# EasyEDA Pro project 智能视觉母版_V2.eprj, board 智能视觉PCB_V2
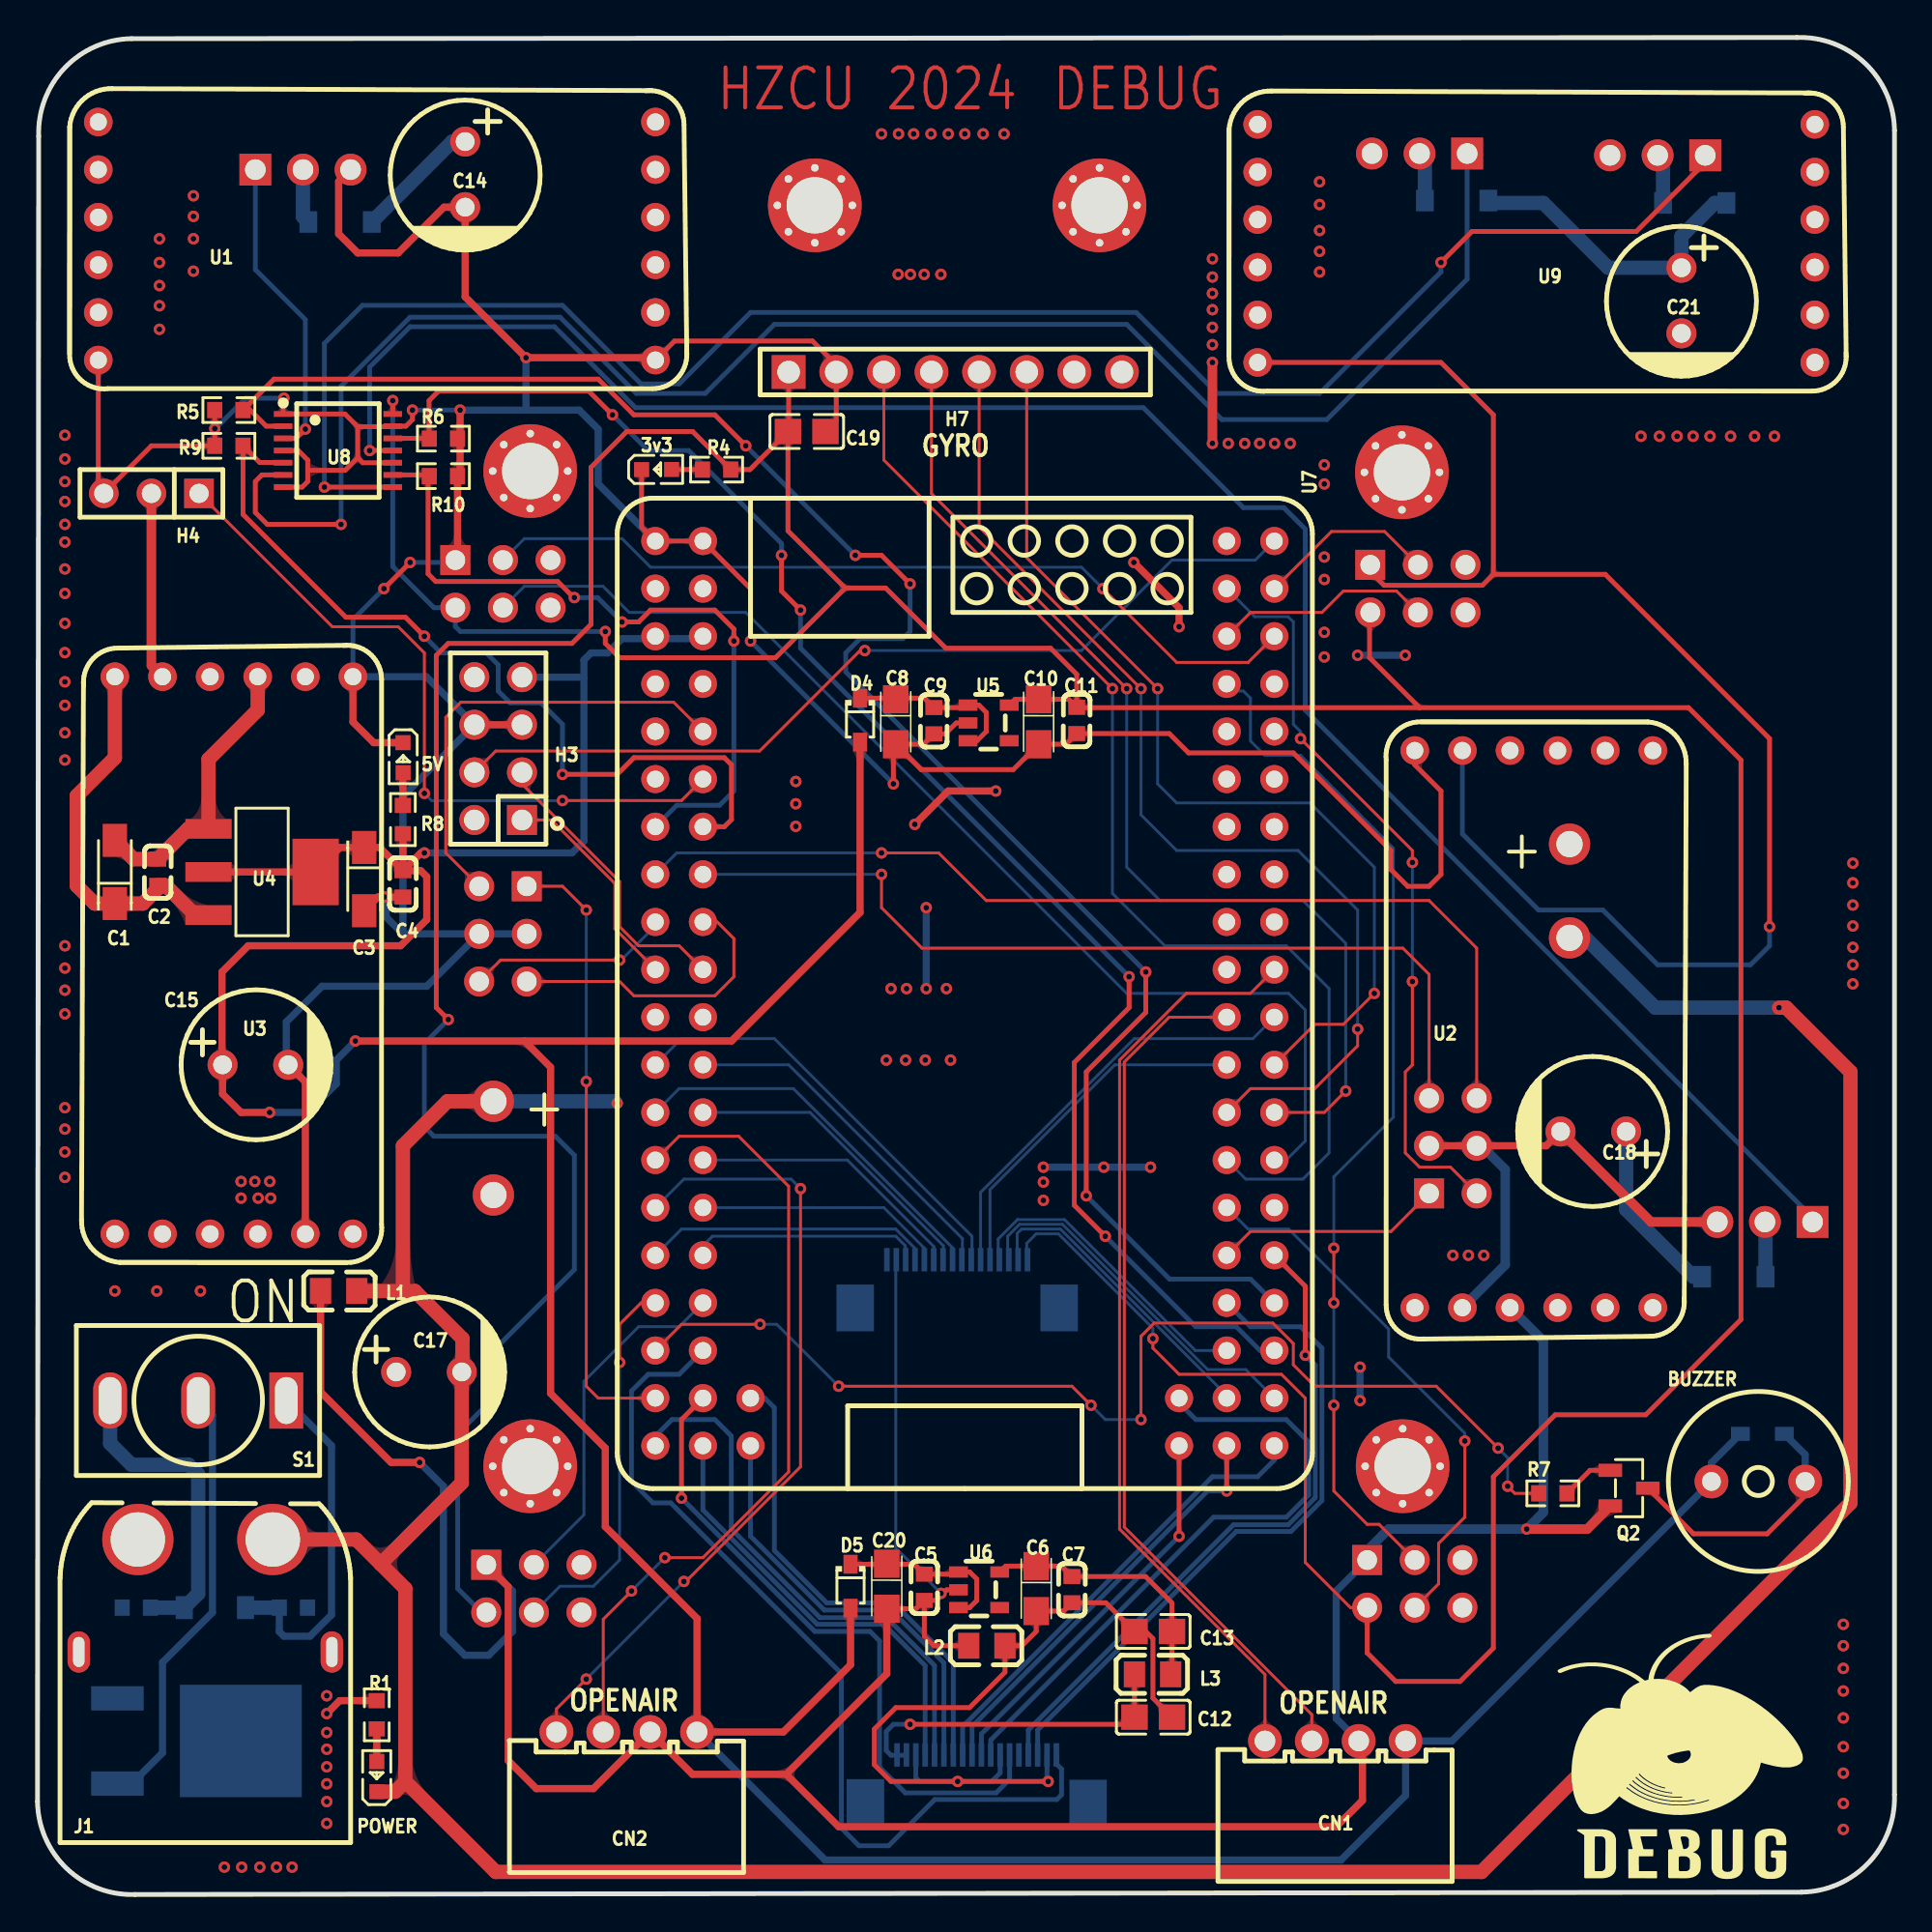
[diagram p1: board, top side]
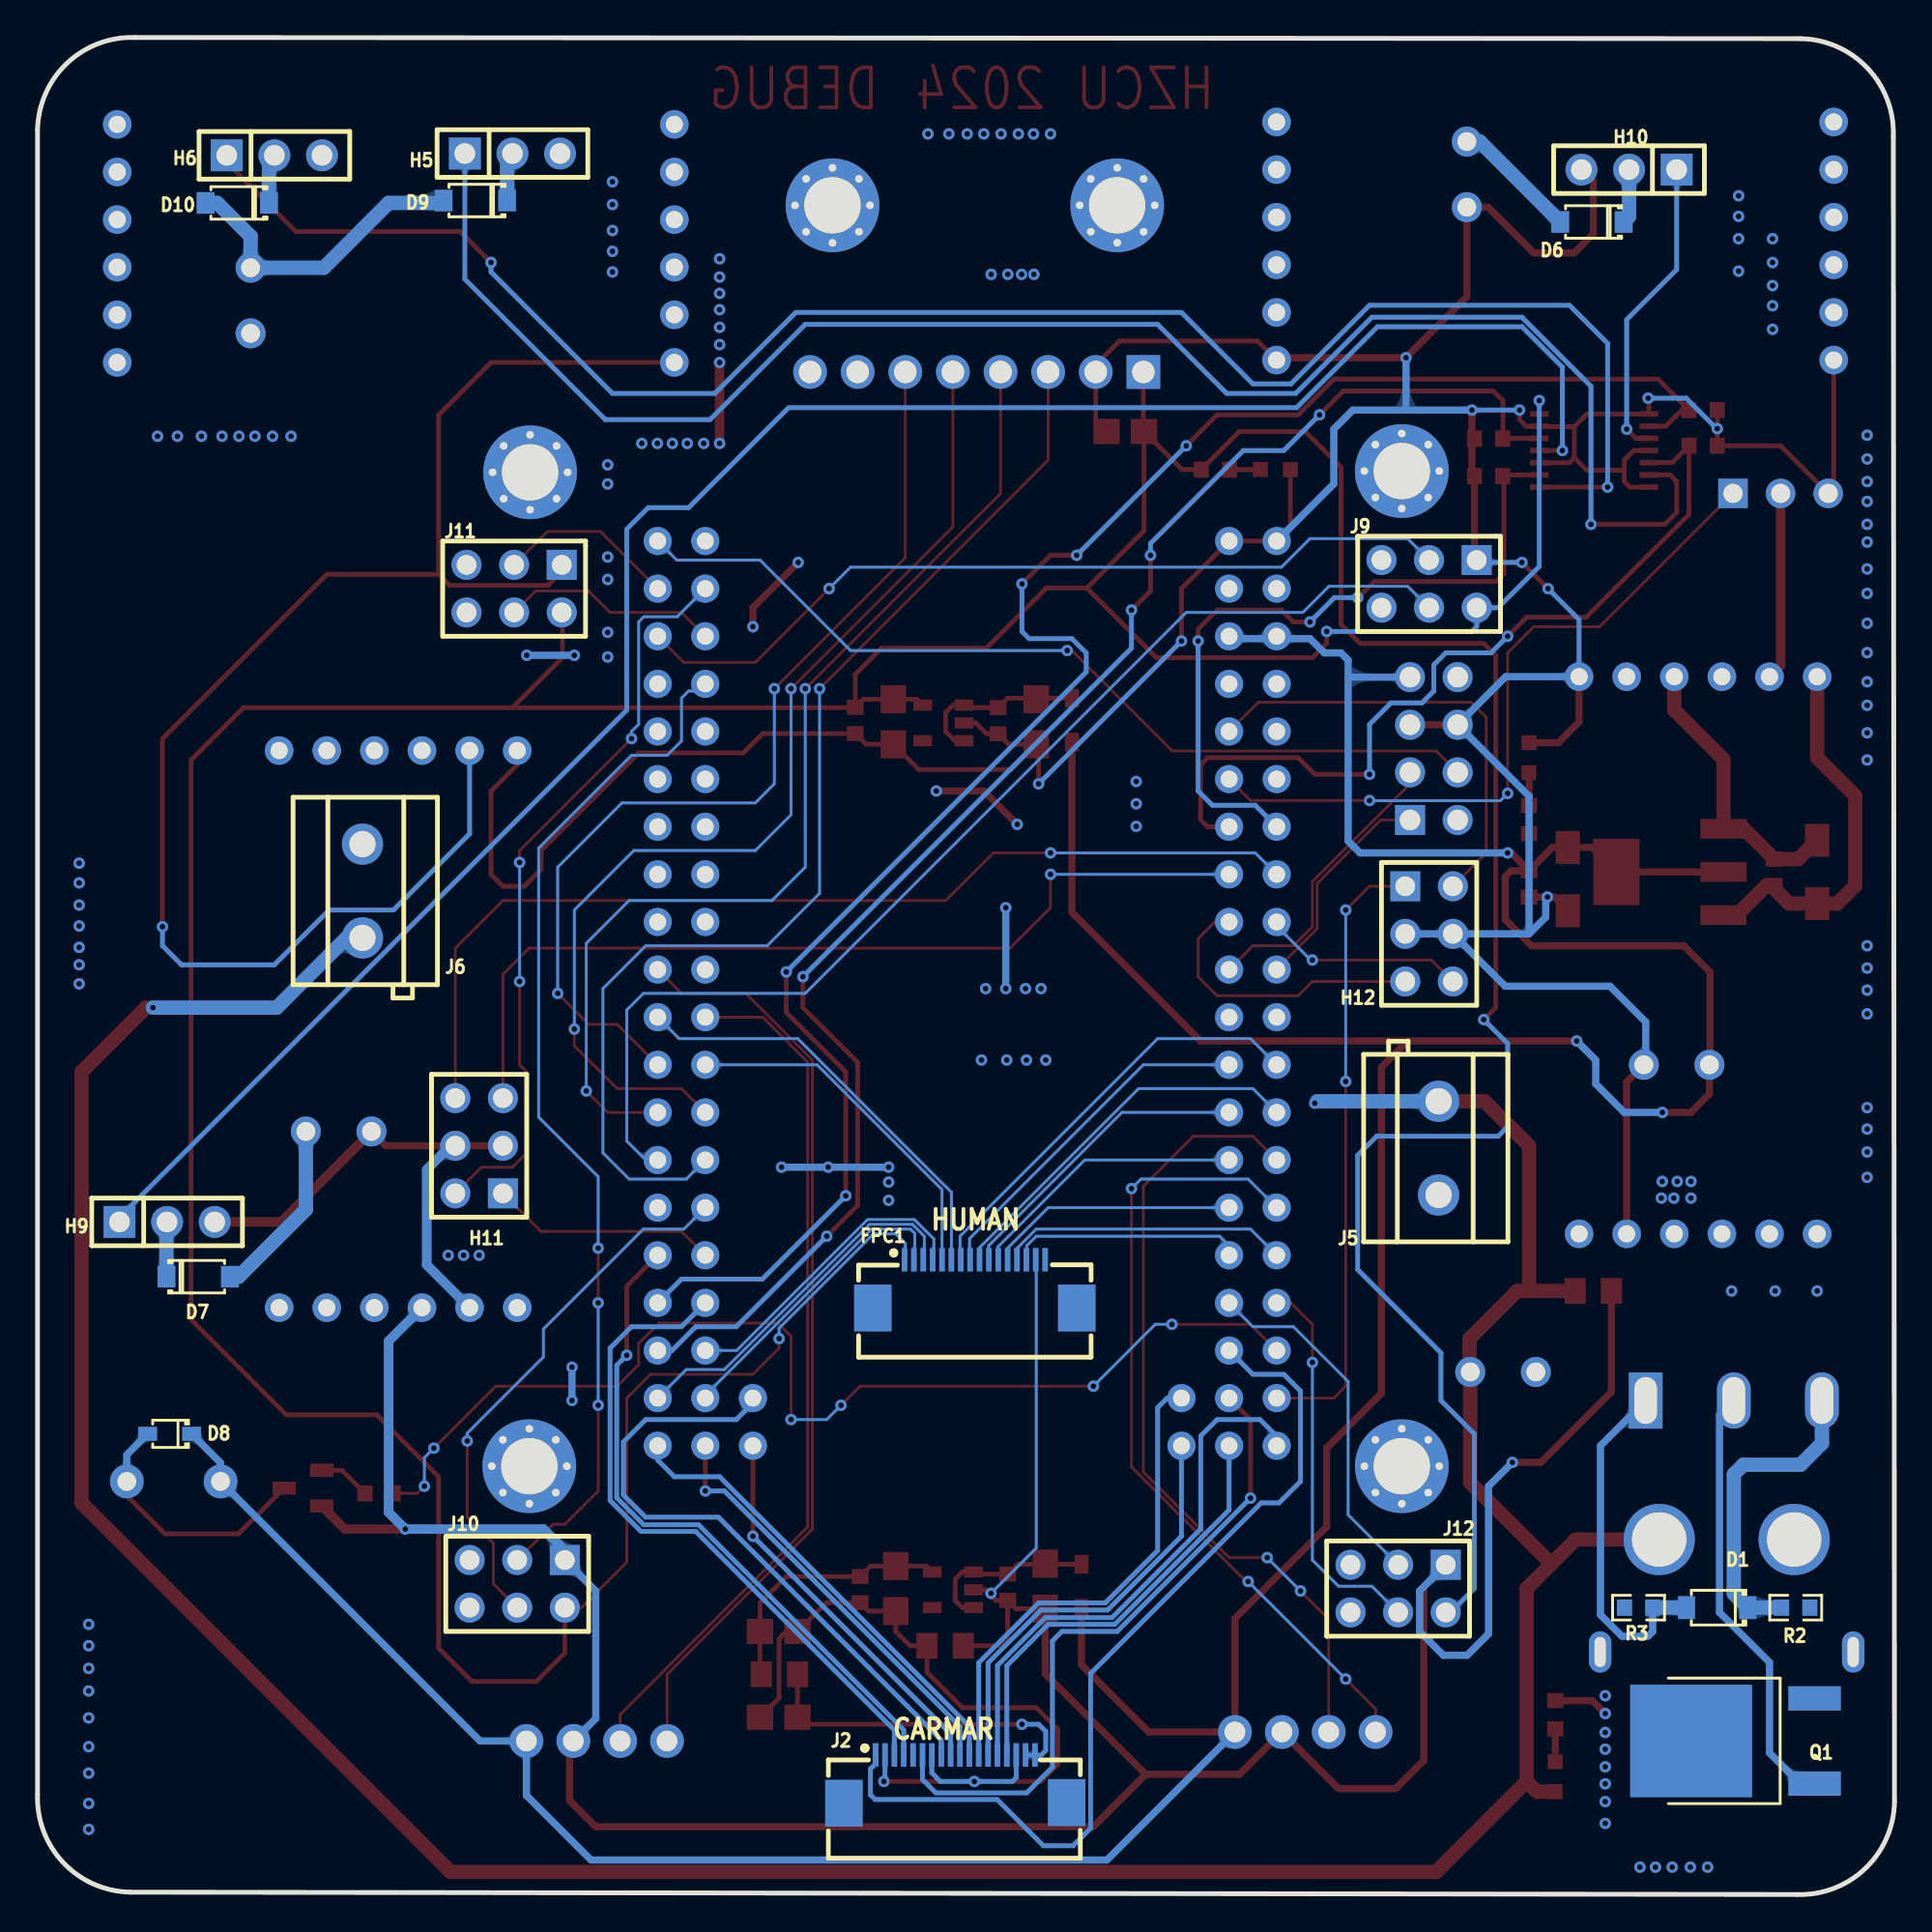
[diagram p2: board, bottom side, seen from below]

Outline 99.06 x 99.06 mm; copper layers: Top Layer, Bottom Layer. Coordinates in mm from the lower left corner of the outline.
Outline path: 0,4.95 0.06,93.79 arc(1.45,97.43) 5.02,99 93.85,99.06 arc(97.5,97.67) 99.06,94.1 99.06,5.33 arc(97.68,1.69) 94.11,0.13 5.21,0 arc(1.56,1.38) 0,4.95
Stack: Top Layer 0.035mm / Dielectric1 1.51mm FR4 er 4.5 / Bottom Layer 0.035mm

## Design rules (mm)
template: JLCPCB Capability(Two Layers Board)
spacing copperThickness1oz (default): track to track 0.102, other pairs 0.152 to 0.3
spacing copperThickness2oz: track to track 0.203, other pairs 0.152 to 0.3
track width copperThickness1oz (default): min 0.127, default 0.254, max 2.54
track width copperThickness2oz: min 0.203, default 0.254, max 2.54
differential pair differentialPair (default): width min 0.127, default 0.254, max 2.54; gap min 0.152, default 0.152
via viaSize (default): diameter min 0.5, default 0.61, max 10; hole min 0.3, default 0.305, max 6.3

## Placement (name value [footprint] x y rotation side)
3v3  NCD0603W1  [LED0603-RD]  33.02 76.01 0 top
5V  NCD0603W1  [LED0603-RD]  19.5 60.64 270 top
B1  M3螺柱孔_JX  [M3]  26.28 22.85 0 top
B2  M3螺柱孔_JX  [M3]  72.78 75.86 0 top
B3  M3螺柱孔_JX  [M3]  26.28 75.93 0 top
B4  M3螺柱孔_JX  [M3]  72.82 22.85 0 top
B5  M3螺柱孔_JX  [M3]  41.47 90.11 0 top
B6  M3螺柱孔_JX  [M3]  56.65 90.11 0 top
BUZZER  3000Hz  [BUZ-TH_BD9.6-P5.00-D0.7-FD]  91.8 22.03 0 top
C1  10uF  [CAP-SMD_L3.2-W1.6-RD-C7171]  4.13 54.55 90 top
C2  100nF  [C0603]  6.41 54.53 270 top
C3  10uF  [CAP-SMD_L3.2-W1.6-RD-C7171]  17.43 54.16 270 top
C4  100nF  [C0603]  19.49 53.91 90 top
C5  100nF  [C0603]  47.31 16.39 90 top
C6  10uF  [CASE-A_3216]  53.28 16.32 270 top
C7  100nF  [C0603]  55.18 16.26 90 top
C8  10uF  [CASE-A_3216]  45.78 62.56 270 top
C9  100nF  [C0603]  47.82 62.61 90 top
C10  10uF  [CASE-A_3216]  53.4 62.56 270 top
C11  100nF  [C0603]  55.44 62.63 90 top
C12  10uF  [C0805]  59.52 9.46 180 top
C13  10uF  [C0805]  59.52 14.03 0 top
C14  100uF  [CAP-TH_BD8.0-P3.50-D0.6-FD]  22.81 91.76 270 top
C15  100uF  [CAP-TH_BD8.0-P3.50-D0.6-FD]  11.62 44.26 0 top
C17  100uF  [CAP-TH_BD8.0-P3.50-D0.6-FD]  20.88 27.88 0 top
C18  100uF  [CAP-TH_BD8.0-P3.50-D0.6-FD]  82.99 40.7 180 top
C19  10uF  [C0805]  41.03 78.04 180 top
C20  10uF  [CASE-A_3216]  45.3 16.45 270 top
C21  100uF  [CAP-TH_BD8.0-P3.50-D0.6-FD]  87.69 85.03 270 top
CN1  XH-4AW  [CONN-TH_XH2.54-4AW]  69.23 8.19 180 top
CN2  XH-4AW  [CONN-TH_XH2.54-4AW]  31.43 8.67 180 top
D1  BZT52C16  [SOD-123_L2.7-W1.6-LS3.7-RD]  9.46 15.3 0 bottom
D4  1N5819WS  [SOD-323_L1.8-W1.3-LS2.5-RD]  43.88 62.64 270 top
D5  1N5819WS  [SOD-323_L1.8-W1.3-LS2.5-RD]  43.37 16.45 270 top
D6  1N5819W  [SOD-123_L2.8-W1.8-LS3.7-RD]  16.14 89.22 0 bottom
D7  1N5819W  [SOD-123_L2.8-W1.8-LS3.7-RD]  90.49 32.96 180 bottom
D8  1N5819WS  [SOD-323_L1.8-W1.3-LS2.5-RD]  92.01 24.57 0 bottom
D9  1N5819W  [SOD-123_L2.8-W1.8-LS3.7-RD]  75.7 90.36 0 bottom
D10  1N5819W  [SOD-123_L2.8-W1.8-LS3.7-RD]  88.4 90.23 0 bottom
FPC1  FPC-05F-16PH20  [FPC-SMD_16P-P0.50_FPC-05F-16PH20]  49.06 32.57 180 bottom
H3  -  [HDR-TH_8P-P2.54-V-F-R2-C4-S2.54-1]  24.57 61.13 90 top
H4  -  [HDR-TH_3P-P2.54-V-F]  6.08 74.74 180 top
H5  -  [HDR-TH_3P-P2.54-V-M]  73.72 92.87 180 bottom
H6  -  [HDR-TH_3P-P2.54-V-M]  86.42 92.77 180 bottom
H7  -  [HDR-TH_8P-P2.54-V-F-1]  48.96 81.22 0 top
H9  -  [HDR-TH_3P-P2.54-V-M]  92.15 35.88 180 bottom
H10  -  [HDR-TH_3P-P2.54-V-M]  14.16 92.01 0 bottom
H11  -  [HDR-TH_6P-P2.54-V-R2-C3-S2.54_A2541WV-2X3P]  75.5 39.94 90 bottom
H12  -  [HDR-TH_6P-P2.54-V-R2-C3-S2.54_A2541WV-2X3P]  24.83 51.24 270 bottom
J1  XT60PW-M  [CONN-TH_XT60PW-M]  8.95 15.94 90 top
J2  J2  [FPC-SMD_18P-P0.50_FPC-05F-18PH20]  50.1 6.16 180 bottom
J5  KF301-5.0-2P  [CONN-TH_P5.00_KF301-5.0-2P]  24.32 39.81 90 bottom
J6  KF301-5.0-2P  [CONN-TH_P5.00_KF301-5.0-2P]  81.72 53.53 270 bottom
J9  -  [HDR-TH_6P-P2.54-V-R2-C3-S2.54_A2541WV-2X3P]  24.83 69.91 0 bottom
J10  -  [HDR-TH_6P-P2.54-V-R2-C3-S2.54_A2541WV-2X3P]  73.47 16.57 0 bottom
J11  -  [HDR-TH_6P-P2.54-V-R2-C3-S2.54_A2541WV-2X3P]  73.63 69.66 0 bottom
J12  -  [HDR-TH_6P-P2.54-V-R2-C3-S2.54_A2541WV-2X3P]  26.48 16.32 0 bottom
L1  CBG201209U000T  [L0805]  16.07 32.19 180 top
L2  CBG201209U000T  [L0805]  50.64 13.27 0 top
L3  CBG201209U000T  [L0805]  59.48 11.75 0 top
POWER  NCD0603R1  [LED0603-RD_RED]  18.1 6.29 90 top
Q1  NCE60P50K  [TO-252-2_L6.6-W6.1-P4.57-LS9.9-TL-CW]  7.56 8.19 0 bottom
Q2  SS8050  [SOT-23-3_L2.9-W1.3-P1.90-LS2.4-BR]  84.9 21.68 180 top
R1  10kΩ  [R0603]  18.1 9.59 270 top
R2  4.7kΩ  [R0603]  5.27 15.3 180 bottom
R3  10kΩ  [R0603]  13.65 15.3 0 bottom
R4  10kΩ  [R0603]  36.23 76.01 180 top
R5  10kΩ  [R0603]  10.21 79.18 180 top
R6  10kΩ  [R0603]  21.65 77.66 0 top
R7  1kΩ  [R0603]  80.84 21.4 0 top
R8  10kΩ  [R0603]  19.49 57.34 90 top
R9  10kΩ  [R0603]  10.21 77.28 180 top
R10  10kΩ  [R0603]  21.65 75.66 0 top
S1  MT-0-102-A101-M200-RS  [sw-th_mt-0-103-a101-m200-rs]  8.57 26.35 0 top
U1  -  [DC_Board]  3.24 81.85 0 top
U2  -  [DC_Board]  73.47 61.02 270 top
U3  -  [DC_Board]  16.83 35.24 90 top
U4  AMS1117-5.0  [SOT-223_L6.5-W3.5-P2.30-LS7.0-BR]  11.98 54.55 180 top
U5  RT9013  [SOT-23-5_L2.9-W1.6-P0.95-LS2.8-BR]  50.74 62.49 180 top
U6  RT9013  [SOT-23-5_L2.9-W1.6-P0.95-LS2.8-BR]  50.23 16.25 180 top
U7  MIMXRT1064xVL_CoreBoard  [MIMXRT1064xVL_CoreBoard - 3D]  49.47 48.07 270 top
U8  SN74HC125PWR  [TSSOP-14_L5.0-W4.4-P0.65-LS6.5-BL]  16.03 77.02 270 top
U9  -  [DC_Board]  65.09 81.72 0 top

## Footprints (pads in the part's own frame, mm; a bottom-side part is the same pattern mirrored in y, then rotated)
BUZ-TH_BD9.6-P5.00-D0.7-FD
  round 1.8 hole 1: 1(-2.5,0) 2(2.5,0)
C0603
  rect 0.8x0.9 smd: 1(-0.7,0) 2(0.7,0)
C0805
  rect 1.41x1.35 smd: 1(-1,0) 2(1,0)
CAP-SMD_L3.2-W1.6-RD-C7171
  rect 1.758x1.296 smd: 1(-1.687,0) 2(1.687,0)
CAP-TH_BD8.0-P3.50-D0.6-FD
  round 1.6 hole 1: 1(-1.75,0) 2(1.75,0)
CASE-A_3216
  rect 1.5x1.359 smd: 1(-1.2,0) 2(1.2,0)
CONN-TH_P5.00_KF301-5.0-2P
  round 2.2 hole 1.4: 1(-2.5,0) 2(2.5,0)
CONN-TH_XH2.54-4AW
  round 1.8 hole 1.1: 1(-3.751,0) 2(-1.248,0) 3(1.251,0) 4(3.751,0)
CONN-TH_XT60PW-M
  round 3.8 hole 2.9: 1(3,-3.6) 2(3,3.6)
  oval 2.2x1.2 hole 1.6x0.6: 3(-3,6.75) 4(-3,-6.75)
DC_Board
  round 1.524 hole 0.914: 1(0,12.7) 1(0,10.16) 1(0,7.62) 2(29.72,12.7) 2(29.72,10.16) 2(29.72,7.62) 3(0,5.08) 3(0,2.54) 3(0,0) 3(29.72,5.08) 3(29.72,2.54) 3(29.72,0)
FPC-SMD_16P-P0.50_FPC-05F-16PH20
  rect 0.3x1.25 smd: 1(-3.75,1.288) 2(-3.25,1.288) 3(-2.75,1.288) 4(-2.25,1.288) 5(-1.75,1.288) 6(-1.25,1.288) 7(-0.75,1.288) 8(-0.25,1.288) 9(0.25,1.288) 10(0.75,1.288) 11(1.25,1.288) 12(1.75,1.288) 13(2.25,1.288) 14(2.75,1.288) 15(3.25,1.288) 16(3.75,1.288)
  rect 2x2.5 smd: 17(5.44,-1.288) 18(-5.44,-1.288)
FPC-SMD_18P-P0.50_FPC-05F-18PH20
  rect 0.3x1.25 smd: 1(-4.25,1.288) 2(-3.75,1.288) 3(-3.25,1.288) 4(-2.75,1.288) 5(-2.25,1.288) 6(-1.75,1.288) 7(-1.25,1.288) 8(-0.75,1.288) 9(-0.25,1.288) 10(0.25,1.288) 11(0.75,1.288) 12(1.25,1.288) 13(1.75,1.288) 14(2.25,1.288) 15(2.75,1.288) 16(3.25,1.288) 17(3.75,1.288) 18(4.25,1.288)
  rect 2x2.5 smd: 19(-5.94,-1.288) 20(5.94,-1.252)
HDR-TH_3P-P2.54-V-F
  rect 1.575x1.575 hole 1.02: 1(-2.54,0)
  round 1.575 hole 1.02: 2(0,0) 3(2.54,0)
HDR-TH_3P-P2.54-V-M
  rect 1.7x1.7 hole 1.1: 1(-2.54,0)
  round 1.7 hole 1.1: 2(0,0) 3(2.54,0)
HDR-TH_6P-P2.54-V-R2-C3-S2.54_A2541WV-2X3P
  rect 1.6x1.6 hole 1.05: 1(-2.54,-1.27)
  round 1.6 hole 1.05: 2(-2.54,1.27) 3(0,-1.27) 4(0,1.27) 5(2.54,-1.27) 6(2.54,1.27)
HDR-TH_8P-P2.54-V-F-1
  rect 1.8x1.8 hole 1.2: 1(-8.89,0)
  round 1.8 hole 1.2: 2(-6.35,0) 3(-3.81,0) 4(-1.27,0) 5(1.27,0) 6(3.81,0) 7(6.35,0) 8(8.89,0)
HDR-TH_8P-P2.54-V-F-R2-C4-S2.54-1
  rect 1.6x1.6 hole 1.1: 1(-3.81,-1.27)
  round 1.6 hole 1.1: 2(-3.81,1.27) 3(-1.27,-1.27) 4(-1.27,1.27) 5(1.27,-1.27) 6(1.27,1.27) 7(3.81,-1.27) 8(3.81,1.27)
L0805
  rect 1.133x1.377 smd: 1(-0.966,0) 2(0.966,0)
LED0603-RD
  rect 0.8x0.8 smd: 1(-0.799,-0.004) 2(0.799,0.004)
LED0603-RD_RED
  rect 0.8x0.8 smd: 1(-0.799,-0.004) 2(0.799,0.004)
M3
  round 0.6 hole 0.405x0.4: 1(-2,0) 1(-1.41,1.409) 1(-1.41,-1.41) 1(0,2) 1(0,-2) 1(1.41,1.409) 1(1.41,-1.41) 1(2,0)
  round 5 hole 3.005x3: 1(0,0)
MIMXRT1064xVL_CoreBoard - 3D
  round 1.5 hole 0.9: 1(-24.13,-16.51) 2(-24.13,-13.97) 3(-21.59,-16.51) 4(-21.59,-13.97) 5(-19.05,-16.51) 6(-19.05,-13.97) 7(-16.51,-16.51) 8(-16.51,-13.97) 9(-13.97,-16.51) 10(-13.97,-13.97) 11(-11.43,-16.51) 12(-11.43,-13.97) 13(-8.89,-16.51) 14(-8.89,-13.97) 15(-6.35,-16.51) 16(-6.35,-13.97) 17(-3.81,-16.51) 18(-3.81,-13.97) 19(-1.27,-16.51) 20(-1.27,-13.97) 21(1.27,-16.51) 22(1.27,-13.97) 23(3.81,-16.51) 24(3.81,-13.97) 25(6.35,-16.51) 26(6.35,-13.97) 27(8.89,-16.51) 28(8.89,-13.97) 29(11.43,-16.51) 30(11.43,-13.97) 31(13.97,-16.51) 32(13.97,-13.97) 33(16.51,-16.51) 34(16.51,-13.97) 35(19.05,-16.51) 36(19.05,-13.97) 37(21.59,-16.51) 38(21.59,-13.97) 39(24.13,-16.51) 40(24.13,-13.97) 41(21.59,-11.43) 42(24.13,-11.43) 43(24.13,11.43) 44(21.59,11.43) 45(24.13,13.97) 46(24.13,16.51) 47(21.59,13.97) 48(21.59,16.51) 49(19.05,13.97) 50(19.05,16.51) 51(16.51,13.97) 52(16.51,16.51) 53(13.97,13.97) 54(13.97,16.51) 55(11.43,13.97) 56(11.43,16.51) 57(8.89,13.97) 58(8.89,16.51) 59(6.35,13.97) 60(6.35,16.51) 61(3.81,13.97) 62(3.81,16.51) 63(1.27,13.97) 64(1.27,16.51) 65(-1.27,13.97) 66(-1.27,16.51) 67(-3.81,13.97) 68(-3.81,16.51) 69(-6.35,13.97) 70(-6.35,16.51) 71(-8.89,13.97) 72(-8.89,16.51) 73(-11.43,13.97) 74(-11.43,16.51) 75(-13.97,13.97) 76(-13.97,16.51) 77(-16.51,13.97) 78(-16.51,16.51) 79(-19.05,13.97) 80(-19.05,16.51) 81(-21.59,13.97) 82(-21.59,16.51) 83(-24.13,13.97) 84(-24.13,16.51)
R0603
  rect 0.806x0.864 smd: 1(-0.753,0) 2(0.753,0)
SOD-123_L2.7-W1.6-LS3.7-RD
  rect 0.91x1.22 smd: 1(-1.635,0) 2(1.635,0)
SOD-123_L2.8-W1.8-LS3.7-RD
  rect 0.95x1.15 smd: 1(-1.692,0) 2(1.692,0)
SOD-323_L1.8-W1.3-LS2.5-RD
  rect 1x0.75 smd: 1(-1.173,0) 2(1.173,0)
SOT-23-3_L2.9-W1.3-P1.90-LS2.4-BR
  rect 1.25x0.7 smd: 1(1,-0.95) 2(1,0.95) 3(-1,0)
SOT-23-5_L2.9-W1.6-P0.95-LS2.8-BR
  rect 1.001x0.6 smd: 1(1.1,-0.95) 2(1.1,0) 3(1.1,0.95) 4(-1.1,0.95) 5(-1.1,-0.95)
SOT-223_L6.5-W3.5-P2.30-LS7.0-BR
  rect 2.465x1.05 smd: 1(2.857,-2.3) 2(2.857,0) 3(2.857,2.3)
  rect 2.465x3.54 smd: 4(-2.857,0)
sw-th_mt-0-103-a101-m200-rs
  rect 1.8x3 hole 1.2x2.5: 1(4.7,0)
  oval 1.8x3 hole 1.2x2.5: 2(0,0) 3(-4.7,0)
TO-252-2_L6.6-W6.1-P4.57-LS9.9-TL-CW
  rect 2.8x1.3 smd: 1(-3.292,2.273) 3(-3.292,-2.273)
  rect 6.5x6 smd: 2(3.292,0)
TSSOP-14_L5.0-W4.4-P0.65-LS6.5-BL
  rect 0.305x0.991 smd: 1(-1.95,-2.925) 2(-1.3,-2.925) 3(-0.65,-2.925) 4(0,-2.925) 5(0.65,-2.925) 6(1.3,-2.925) 7(1.95,-2.925) 8(1.95,2.925) 9(1.3,2.925) 10(0.65,2.925) 11(0,2.925) 12(-0.65,2.925) 13(-1.3,2.925) 14(-1.95,2.925)

## Nets
As in the schematic.

Pads without a net: B1 1; B2 1; B3 1; B4 1; B5 1; B6 1; FPC1 16 17 18; H3 2 8; H7 7 8; J1 3 4; J2 5 19 20; J9 5 6; J10 5 6; J11 5 6; J12 5 6; U5 4; U6 4; U7 3 4 7 8 9 11 21 22 65 67 68 69 70 71 72 73 74 75 76 78 83

## Via types
v1: diameter 0.61, hole 0.305, Top Layer to Bottom Layer, 226 vias

## Routing (per net, layer and track width the routed paths; a pad name or vN(x,y) marks a point on that pad's centre or on a via; arc(x,y) is an arc through that point)
3V3: length 305.6
  Top Layer w0.152: J10.2 70.04,15.3 67.63,17.72 67.63,26.48 66.36,27.75 60.9,27.75 59.5,29.15 v1(59.5,29.65)
  Top Layer w0.254: 43.08,69.69 45.24,69.69 48.45,66.48 54.04,66.48 55.44,65.09 C11.2 ; 43.08,69.69 39.37,65.98 31.05,65.98 30.29,66.74 v1(30.29,67.37) ; 43.08,69.69 40.03,72.74 C19.2 ; 73.72,63.31 88.07,63.31 90.87,60.51 90.87,30.67 85.79,25.59 80.96,25.59 77.66,22.29 77.66,13.14 75.88,11.37 72.45,11.37 70.93,12.89 J10.2 ; 73.72,63.31 55.46,63.31 C11.2 ; 73.72,63.31 71.06,65.98 71.06,68.35 J11.2 ; H7.1 40.07,78.07 C19.2 ; C19.2 38,76.01 R4.1 34.95,78.04 31.43,78.04 29.53,76.14 29.53,67.75 28.51,66.74 21.91,66.74 21.27,66.1 21.27,47.31 v1(21.91,46.67) ; U5.5 52.15,63.76 C10.1 55.01,63.76 C11.2 ; U8.14 v1(18.95,79.69)
  Bottom Layer w0.152: v1(59.5,29.65) 59.5,30.2 54.46,35.24 53.28,35.24 52.77,34.73 52.77,34.08
  Bottom Layer w0.254: J12.2 23.69,15.05 22.42,16.32 22.42,24.57 24.19,26.35 24.19,28.89 28.64,33.34 28.64,39.43 27.62,40.45 21.15,40.45 20.64,40.96 20.64,45.4 v1(21.91,46.67) ; v1(18.95,79.69) 18.95,70.84 21.15,68.64 J9.2 22.29,67.64 22.56,67.37 v1(30.29,67.37)
3V3_CAM: length 14
  Top Layer w0.254: U6.5 51.64,17.52 C6.1 54.63,17.52 C7.2 59.11,16.96 60.52,15.56 60.52,14.03 C13.2 60.52,11.82 L3.2
6V: length 30.6
  Top Layer w0.508: H4.2 6.08,65.55 U3.2
  Top Layer w0.762: U3.2 4.13,60.64 2.1,58.61 2.1,53.81 3.05,52.86 C1.1 5.62,52.86 6.41,53.66 C2.2 6.83,53.83 8.41,52.25 U4.3
8V_1: length 6.8
  Bottom Layer w0.762: C14.1 22.12,93.51 D6.2
8V_2: length 9.7
  Bottom Layer w0.762: C18.1 84.74,36.54 88.33,32.96 D7.2
8V_3: length 16.6
  Bottom Layer w0.762: D9.2 77.52,90.23 80.33,90.23 83.78,86.78 C21.1 87.69,88.45 89.47,90.23 D10.2
+5V: length 238.1
  Top Layer w0.381: v1(20.64,55.56) 20.45,55.56 C4.2 ; 25.97,45.53 37.02,45.53 43.88,52.39 D4.2 ; 25.97,45.53 27.37,44.13 27.37,26.73 30.29,23.81 30.29,19.62 35.18,14.73 CN2.1 39.79,8.67 43.37,12.25 D5.2 ; 25.97,45.53 v1(16.95,45.53) ; C4.2 19.49,56.58 R8.1 ; C4.2 20.45,54.61 20.76,54.29 20.76,52.01 19.37,50.61 11.24,50.61 9.84,49.21 9.84,44.29 C15.1 9.87,42.71 10.86,41.72 v1(12.38,41.72) ; C4.2 18.25,55.85 C3.1 16.14,55.85 U4.4 U4.2
  Bottom Layer w0.381: CN2.1 42.01,1.84 69.53,1.84 72.98,5.29 CN1.1 75.45,8.19 BUZZER.1 89.3,23.03 D8.1 ; v1(16.95,45.53) 15.94,44.51 15.94,43.24 14.41,41.72 v1(12.38,41.72) ; v1(20.64,55.56) 28.51,55.56 29.15,56.2 29.15,64.87 ; 29.15,64.87 29.08,64.94 H3.7 ; 29.15,64.87 29.15,65.85 29.53,66.23 30.42,66.23 31.18,66.99 35.37,66.99 U7.6
GND: length 578.7
  Top Layer w0.254: U6.2 48.5,16.25 47.94,15.69 C5.1 ; U2.3 73.47,60.26 74.87,58.86 74.87,54.42 74.23,53.78 73.09,53.78 72.2,54.67 72.2,55.69 66.99,60.9 61.4,60.9 60.37,61.93 C11.1 54.87,61.36 C10.2 52.05,60.01 47.13,60.01 C8.2 ; U5.2 49.01,62.49 48.43,61.91 C9.1 47.26,61.36 C8.2 ; 14.41,75.97 16.41,75.97 17.08,76.64 ; 14.41,75.97 14.41,76.52 13.91,77.02 U8.4 ; 14.41,75.97 14.41,75.37 14.12,75.07 U8.7 ; J11.1 71.09,70.57 71.83,69.84 77.08,69.84 77.66,70.42 ; 3v3.1 32.22,72.93 U7.1 U7.2 38.04,69.66 v1(38.04,66.86) ; v1(92.39,51.62) 92.39,61.66 83.63,70.42 77.66,70.42 ; U1.3 3.24,75.03 H4.3 6.08,77.28 R9.2 v1(9.46,78.19) R5.2 ; 17.08,76.64 17.35,76.37 U8.10 ; 17.08,76.64 17.08,78.29 ; C5.1 46.86,15.25 C20.2 ; C5.1 47.31,13.78 47.82,13.27 L2.1 ; 77.66,70.42 77.66,78.93 74.87,81.72 U9.3 ; C8.2 45.66,61.23 v1(45.66,59.24) ; v1(18.48,69.66) v1(19.88,71.06) ; 13.1,79.69 U8.1 16.4,78.97 17.08,78.29 ; C19.1 42.61,78.62 42.61,81.6 41.34,82.87 33.98,82.87 U1.3 ; 17.08,78.29 18.92,78.29 U8.13 19.65,78.32 20,78.68 v1(20,79.18)
  Top Layer w0.381: C4.1 v1(18.52,53.21) 18.16,53.21 C3.2 ; L1.2 15.1,26.81 18.86,23.05 v1(20.38,23.05) ; C18.2 80.48,39.94 H11.4 H11.3 ; v1(51.12,58.86) 48.58,58.86 v1(46.8,57.09) ; U3.3 16.83,62.55 17.93,61.44 5V.1 ; U3.3 14.29,43.34 C15.2 ; v1(58.48,71.06) 60.9,68.64 v1(60.9,67.63) ; C20.2 45.3,11.77 39.94,6.41 ; U1.3 32.84,81.98 v1(26.06,81.98) 22.81,85.22 C14.2 21.68,90.01 19.24,87.57 17.08,87.57 16.07,88.58 16.07,91.38 H10.3 ; H3.6 H3.5 ; 22.54,77.79 R6.2 ; 22.54,77.79 22.54,75.79 R10.2 22.41,71.3 J9.1 ; 22.54,77.79 v1(22.54,79.18) ; 39.94,6.41 34.94,6.41 CN2.2 32.67,8.67 29.65,5.65 26.61,5.65 25.11,7.15 25.11,16.42 J12.1 ; 39.94,6.41 42.74,3.62 69.28,3.62 70.68,5.02 70.68,7.99 CN1.2
  Top Layer w0.508: C18.2 86.07,35.88 H9.3 ; v1(79.44,19.49) 82.67,19.49 Q2.2
  Top Layer w0.762: U3.3 11.75,63.18 9.12,60.56 U4.1 8.03,56.85 C2.1 5.13,55.23 C1.2
  Bottom Layer w0.152: FPC1.15 45.78,33.84 45.78,18.48 v1(48.2,16.06)
  Bottom Layer w0.254: 9.46,78.17 11.11,79.82 v1(13.14,79.82) ; v1(19.88,71.06) 22.16,71.06 J9.1 ; 18.35,69.53 16.83,68.01 U3.3 ; v1(92.39,51.62) 92.39,50.61 91.38,49.59 86.42,49.59 83.5,52.51 80.07,52.51 76.01,56.58 U2.3 ; v1(38.04,66.86) v1(45.66,59.24) ; v1(22.54,79.18) v1(20,79.18)
  Bottom Layer w0.381: v1(20.38,23.05) 21.65,21.78 21.65,13.91 22.8,12.76 24.07,12.76 25.34,14.03 25.34,16.19 J12.1 ; v1(53.66,38.8) v1(56.88,38.8) v1(59.37,38.8) ; v1(72.96,66.1) v1(70.42,66.1) ; v1(18.52,53.21) 18.61,53.12 18.61,52.13 19.49,51.24 ; C15.2 13.27,44.36 13.27,46.54 15.18,48.45 20.76,48.45 H12.4 ; 26.06,79.18 28.89,79.18 29.91,78.17 29.91,75.25 U7.1 ; 26.06,79.18 v1(26.06,81.98) ; 26.06,79.18 v1(22.54,79.18) ; v1(47.41,48.32) v1(47.41,52.64) ; CN1.2 69.28,9.39 69.28,16.19 J10.1 ; H12.4 H12.3 ; H12.4 19.49,51.24 ; 19.49,51.24 19.49,58.59 H3.6 20.74,64.96 U3.3 ; v1(70.55,28.13) v1(70.55,26.35)
  Bottom Layer w0.508: J10.1 70.93,18.35 72.07,19.49 v1(79.44,19.49) 80.33,20.38 80.33,29.52 U2.3 ; U2.3 78.3,33.59 78.3,38.67 77.03,39.94 H11.4
  vias: v1(6.5,88.32) v1(6.5,87.05) v1(6.5,85.82) v1(6.5,84.75) v1(6.5,83.49) v1(8.32,90.61) v1(8.32,89.52) v1(8.32,88.32) v1(8.32,86.59) v1(9.97,1.46) v1(10.86,38.04) v1(10.86,37.15) v1(10.89,1.46) v1(11.59,38.04) v1(11.77,37.15) v1(11.86,1.46) v1(12.39,38.04) v1(12.44,37.15) v1(12.75,1.46) v1(13.58,1.46) v1(40.45,59.37) v1(40.45,58.18) v1(40.45,56.98) v1(45.28,44.51) v1(45.53,48.32) v1(45.91,86.42) v1(46.31,44.51) v1(46.36,48.32) v1(46.57,86.42) v1(47.3,86.42) v1(47.36,44.51) v1(48.19,86.42) v1(48.49,48.32) v1(48.7,44.51) v1(53.66,38) v1(53.66,37.03) v1(75.5,34.1) v1(76.33,34.1) v1(77.15,34.1) v1(85.53,77.79) v1(86.52,77.79) v1(87.46,77.79) v1(88.32,77.79) v1(89.22,77.79) v1(90.31,77.79) v1(91.6,77.79) v1(92.66,77.79) v1(96.33,14.41) v1(96.33,13.27) v1(96.33,12.06) v1(96.33,10.86) v1(96.33,9.42) v1(96.33,7.88) v1(96.33,6.47) v1(96.33,4.86) v1(96.33,3.47) v1(96.84,55.01) v1(96.84,53.96) v1(96.84,52.78) v1(96.84,51.66) v1(96.84,50.52) v1(96.84,49.59) v1(96.84,48.58)
GNDBAT: length 188.9
  Top Layer w0.762: 19.62,6.03 19.08,5.49 18.11,5.49 ; 19.62,6.03 24.45,1.21 77.03,1.21 96.71,20.89 96.71,43.88 93.28,47.31 v1(92.9,47.31) ; 19.62,6.03 19.62,16.32 18.31,17.63 ; 19.49,32.19 20.13,32.19 22.67,29.65 22.67,27.91 C17.2 22.63,21.96 18.31,17.63 ; 19.49,32.19 19.49,39.94 21.87,42.31 J5.2 ; 19.49,32.19 L1.1 ; J1.1 17,18.94 18.31,17.63
  Bottom Layer w0.762: J6.2 82.57,51.03 86.3,47.31 v1(92.9,47.31) ; 30.8,42.31 J5.2
  vias: v1(30.92,42.21)
GNDCAM: length 44.4
  Top Layer w0.254: C12.1 59.5,10.48 59.5,13.65 59.12,14.03 C13.1 56.99,15.56 C7.1 54.74,15.12 C6.2 53.28,14.03 52.51,13.27 51.61,13.27 51.61,11.86 49.72,9.97 45.78,9.97 44.64,8.83 44.64,6.92 45.53,6.03 v1(49.09,6.03) v1(53.91,6.03)
  Bottom Layer w0.254: v1(53.91,6.03) 53.85,6.09 J2.2 ; J2.7 51.35,6.49 50.9,6.03 v1(49.09,6.03) 47.05,6.03 46.85,6.23 J2.16
VCCBAT: length 7.3
  Top Layer w0.381: R1.1 16.12,10.34 v1(15.43,9.65)
  Top Layer w0.508: v1(62.67,81.72) v1(62.67,77.41)
  vias: v1(1.46,77.84) v1(1.46,76.58) v1(1.46,75.37) v1(1.46,74.31) v1(1.46,73.09) v1(1.46,72.14) v1(1.46,70.71) v1(1.46,69.4) v1(1.46,67.81) v1(1.46,66.25) v1(1.46,64.69) v1(1.46,63.44) v1(1.46,61.97) v1(1.46,60.52) v1(1.46,50.61) v1(1.46,49.42) v1(1.46,48.24) v1(1.46,46.97) v1(1.46,41.97) v1(1.46,40.83) v1(1.46,39.61) v1(1.46,38.25) v1(4.13,32.19) v1(6.37,32.19) v1(8.69,32.19) v1(15.43,10.6) v1(15.43,8.64) v1(15.43,7.75) v1(15.43,6.81) v1(15.43,5.9) v1(15.43,4.96) v1(15.43,3.79) v1(45.02,93.92) v1(45.93,93.92) v1(46.74,93.92) v1(47.66,93.92) v1(48.58,93.92) v1(49.47,93.92) v1(50.44,93.92) v1(51.56,93.92) v1(62.67,87.25) v1(62.67,86.28) v1(62.67,85.41) v1(62.67,84.54) v1(62.67,83.6) v1(62.67,82.67) v1(63.52,77.41) v1(64.4,77.41) v1(65.19,77.41) v1(65.99,77.41) v1(66.82,77.41) v1(68.39,91.36) v1(68.39,90.15) v1(68.39,88.76) v1(68.39,87.65) v1(68.39,86.55) v1(68.64,76.26) v1(68.64,75.24) v1(68.64,71.34) v1(68.64,70.15) v1(68.64,67.33) v1(68.64,66.01)
B0: length 23.3
  Bottom Layer w0.152: U7.23 34.35,45.66 39.31,45.66 49.85,35.11 49.85,33.61
B1: length 19.1
  Bottom Layer w0.152: U7.24 40.07,44.26 49.34,34.99 49.34,33.62
B2: length 20.8
  Bottom Layer w0.152: U7.25 34.23,42.99 40.32,42.99 48.83,34.48 48.83,33.63
B3: length 16.7
  Bottom Layer w0.152: 48.32,33.64 48.32,34.61 41.21,41.72 U7.26
B9: length 16.4
  Bottom Layer w0.152: U7.49 61.76,29.02 54.78,36 52.28,36 51.24,34.97 51.24,34.08
B10: length 19.3
  Bottom Layer w0.152: U7.48 64.45,28 62.42,28 54.67,35.75 52.39,35.75 51.75,35.11 51.75,34.09
B11: length 16.3
  Bottom Layer w0.152: U7.47 63.44,26.63 54.57,35.5 52.49,35.5 52.26,35.26 52.26,34.1
B12: length 43
  Top Layer w0.152: v1(34.48,16.7) 34.59,16.7 40.7,22.82 v1(40.7,37.65) ; v1(29.27,11.49) 27.68,9.9 CN2.4
  Bottom Layer w0.152: v1(40.7,37.65) 40.2,38.16 34.48,38.16 U7.29 ; v1(29.27,11.49) v1(34.48,16.7)
B13: length 43.1
  Top Layer w0.152: v1(33.46,17.97) 35.5,17.97 40.07,22.54 40.07,37.78 37.4,40.45 34.23,40.45 U7.27 ; v1(31.69,16.19) 30.18,14.69 CN2.3
  Bottom Layer w0.152: v1(31.69,16.19) v1(33.46,17.97)
B14: length 13.5
  Bottom Layer w0.152: 47.31,33.65 47.31,34.48 45.15,36.64 U7.30
B15: length 15.1
  Bottom Layer w0.152: 47.82,33.64 47.82,34.56 43.2,39.18 U7.28
B16: length 12.5
  Bottom Layer w0.152: 46.29,33.88 46.29,34.61 45.78,35.11 36,35.11 35.5,34.61 U7.32
B17: length 15.7
  Bottom Layer w0.152: 46.8,33.66 46.8,34.48 45.78,35.5 34.35,35.5 U7.31
B18: length 19
  Bottom Layer w0.152: J12.3 29.15,20.26 29.15,27.37 32.07,30.29 34.23,30.29 U7.34
B19: length 20.7
  Top Layer w0.152: U7.33 32.19,31.56 31.05,30.42 v1(31.05,28.38)
  Bottom Layer w0.152: v1(31.05,28.38) 31.05,17.84 29.65,16.45 27.88,16.45 J12.4
B21: length 59.9
  Top Layer w0.152: U7.35 34.35,30.42 v1(38.54,30.42) ; v1(42.74,27.11) 55.18,27.11 v1(56.2,26.1) ; v1(78.42,21.78) 78.8,21.4 R7.1 ; v1(77.91,23.81) 74.61,27.11 68.14,27.11 66.99,28.26 66.99,29.39 65.9,30.48 59.57,30.48 58.86,29.78 v1(58.86,25.34)
  Bottom Layer w0.152: v1(42.74,27.11) 39.43,30.42 v1(38.54,30.42) ; v1(77.91,23.81) 78.42,23.3 v1(78.42,21.78) ; v1(58.86,25.34) 56.96,25.34 v1(56.2,26.1)
B23: length 33
  Top Layer w0.152: v1(29.27,52.51) 28,53.78 H12.1 ; U7.37 29.91,26.48 29.27,27.11 v1(29.27,43.37)
  Bottom Layer w0.152: v1(29.27,52.51) v1(29.27,43.37)
C0: length 9.7
  Top Layer w0.152: J11.3 71.86,72.71 69.02,72.71 U7.82
C1: length 11.7
  Top Layer w0.152: J11.4 72.49,69.53 69.66,69.53 68.52,68.39 64.71,68.39 U7.79
C2: length 44.9
  Top Layer w0.152: U7.80 64.58,65.72 60.77,65.72 v1(56.83,69.66)
  Bottom Layer w0.152: J9.3 25.97,72.33 31.18,72.33 32.7,70.8 55.69,70.8 v1(56.83,69.66)
C3: length 55.3
  Top Layer w0.152: J10.3 71.56,19.75 70.93,19.75 69.15,21.53 v1(69.15,26.1) ; v1(69.15,31.56) v1(69.15,34.48)
  Bottom Layer w0.152: U7.77 63.82,64.2 64.33,64.2 64.71,63.82 64.71,61.53 65.47,60.77 67.37,60.77 72.33,55.82 72.33,41.46 69.15,38.29 v1(69.15,34.48) ; v1(69.15,26.1) v1(69.15,31.56)
C16: length 49.8
  Top Layer w0.152: CN1.4 65.48,11.74 57.72,19.49 57.72,44.51 61.28,48.07 64.71,48.07 U7.66
C17: length 46.8
  Top Layer w0.152: CN1.3 67.98,9.6 57.98,19.6 57.98,44.41 60.37,46.8 U7.63
C18: length 23.1
  Bottom Layer w0.152: FPC1.6 50.31,33.87 50.31,37.46 58.51,45.66 64.83,45.66 U7.64
C19: length 19.1
  Bottom Layer w0.152: FPC1.5 50.81,37.6 57.47,44.26 U7.61
C20: length 51.9
  Top Layer w0.152: U7.62 68.14,46.42 69.66,46.42 v1(71.31,48.07) ; H7.6 52.77,71.31 v1(59.75,64.32)
  Bottom Layer w0.152: v1(59.75,64.32) 59.75,59.24 60.77,58.23 67.88,58.23 71.31,54.8 v1(71.31,48.07)
C21: length 56.6
  Top Layer w0.152: v1(70.42,46.16) 70.42,45.27 68.14,42.99 64.71,42.99 U7.59 ; v1(58.86,64.32) 58.86,64.32 50.23,72.95 50.23,81.22
  Bottom Layer w0.152: v1(70.42,46.16) 70.42,52.51 67.25,55.69 60.77,55.69 58.86,57.59 v1(58.86,64.32)
C22: length 56.3
  Top Layer w0.152: H7.4 47.69,74.73 58.09,64.32 v1(58.1,64.32) ; U7.60 68.64,41.72 v1(69.79,42.86)
  Bottom Layer w0.152: v1(69.79,42.86) 69.79,50.74 67.5,53.02 59.88,53.02 58.1,54.8 v1(58.1,64.32)
C23: length 61.7
  Top Layer w0.152: v1(57.34,64.32) 45.15,76.52 H7.3
  Bottom Layer w0.152: v1(57.34,64.32) 57.34,53.4 60.13,50.61 66.61,50.61 68.9,48.32 68.9,39.56 67.5,38.16 64.45,38.16 U7.57
C24: length 61.7
  Bottom Layer w0.152: J9.4 25.97,69.79 30.16,69.79 31.56,68.39 37.78,68.39 58.1,48.07 66.74,48.07 67.63,47.18 67.63,40.19 66.61,39.18 U7.58
C25: length 29
  Top Layer w0.152: v1(76.14,24.19) 76.14,20.13 74.74,18.73 74.74,16.57 J10.4
  Bottom Layer w0.152: v1(76.14,24.19) 76.14,24.61 72.07,28.67 72.07,30.16 66.74,35.5 64.58,35.5 U7.55
C27: length 12.2
  Top Layer w0.152: H11.1 72.2,35.37 64.71,35.37 U7.53
C30: length 99
  Top Layer w0.254: v1(43.62,71.44) 45.02,71.44 v1(46.55,69.91) ; v1(37.78,77.28) 36.13,78.93 31.81,78.93 29.91,80.83 12.61,80.83 R5.1 11.34,79.18 12.2,78.32 U8.2 ; v1(59.12,49.21) 59.12,47.05 55.94,43.88 v1(55.94,37.27)
  Bottom Layer w0.254: v1(55.94,37.27) 60.39,32.83 64.71,32.83 U7.52 ; v1(46.55,69.91) 46.55,67.37 46.16,66.99 43.88,66.99 43.12,66.23 43.12,65.21 v1(59.12,49.21) ; v1(37.78,77.28) v1(43.62,71.44)
C30_A: length 16.3
  Top Layer w0.254: U8.3 13.79,77.67 v1(14.29,78.17)
  Bottom Layer w0.254: H10.1 11.62,86.68 14.29,84.01 v1(14.29,78.17)
C31: length 84.4
  Top Layer w0.254: v1(56.96,35.11) 55.31,36.77 55.31,44.39 58.23,47.31 v1(58.23,48.96) ; v1(30.67,78.93) 29.4,80.2 21.4,80.2 20.89,79.68 20.89,77.67 ; v1(40.7,68.52) 39.69,69.53 v1(39.69,71.44) ; 20.89,77.67 R6.1 ; 20.89,77.67 U8.12
  Bottom Layer w0.254: v1(30.67,78.93) 32.58,77.02 34.73,77.02 39.69,72.07 v1(39.69,71.44) ; v1(40.7,68.52) 40.7,66.48 v1(58.23,48.96) ; v1(56.96,35.11) 61.79,30.29 63.94,30.29 65.21,29.02 U7.50
C31_A: length 109.1
  Top Layer w0.254: v1(17.72,77.02) U8.11
  Bottom Layer w0.254: H9.1 94.69,36.11 67.63,63.18 67.63,72.83 66.48,73.98 64.33,73.98 58.99,79.31 31.9,79.31 27.58,83.63 19.87,83.63 17.72,81.47 v1(17.72,77.02)
D0: length 45.5
  Top Layer w0.254: U7.14 36.64,56.96 37.02,57.34 37.02,60.26 36.64,60.64 31.81,60.64 30.92,59.75 v1(28,59.75) ; U8.5 13.09,76.39 11.85,76.39 R9.1 10.96,73.62 16.45,68.13 19.62,68.13 v1(20.64,67.12)
  Bottom Layer w0.254: v1(20.64,67.12) 21.53,66.23 23.94,66.23 24.57,65.59 24.57,64.2 25.21,63.56 26.86,63.56 28,62.42 v1(28,59.75)
D0_A: length 92.2
  Top Layer w0.254: U8.6 11.97,75.72 11.62,75.37 11.62,73.72 12.26,73.09 v1(16.19,73.09)
  Bottom Layer w0.254: v1(16.19,73.09) 16.19,80.45 19.88,84.14 27.88,84.14 31.94,80.07 35.62,80.07 39.31,83.76 58.1,83.76 63.18,78.68 68.77,78.68 76.26,86.17 H5.1
D1: length 38.9
  Top Layer w0.254: v1(37.15,66.86) 37.15,67.5 36.13,68.52 32.7,68.52 32.07,67.88 v1(31.18,67.88) ; 20.83,75.72 20.83,70.45 21.25,70.04 27.75,70.04 28.64,69.15 ; 20.83,75.72 R10.1 ; 20.83,75.72 U8.9
  Bottom Layer w0.254: v1(31.18,67.88) 29.88,69.18 v1(28.64,69.18) ; U7.13 34.1,58.1 36.39,58.1 37.15,58.86 v1(37.15,66.86)
D1_A: length 96.7
  Top Layer w0.254: U8.8 v1(15.3,75.07) ; v1(74.87,87.06) 76.52,88.71 85.28,88.71 88.96,92.39 H6.1
  Bottom Layer w0.254: v1(15.3,75.07) 15.3,82.74 17.34,84.77 28,84.77 32.19,80.58 34.23,80.58 38.04,84.39 58.61,84.39 62.93,80.07 68.39,80.07 74.87,86.55 v1(74.87,87.06)
D2: length 38.5
  Top Layer w0.152: v1(20.64,58.74) 20.64,66.23 19.24,67.63 15.73,67.63 8.62,74.74 ; U7.12 34.35,58.36 v1(28,58.36)
  Bottom Layer w0.152: v1(28,58.36) 27.99,58.35 21.03,58.35 v1(20.64,58.74)
D4: length 24.4
  Top Layer w0.152: U7.10 33.94,63.6 22.58,63.6 21.78,62.8 21.78,55.56 H12.2
D12: length 54.4
  Top Layer w0.152: H11.6 76.77,50.48 74.23,53.02 50.61,53.02 48.07,55.56 v1(45.02,55.56)
  Bottom Layer w0.152: v1(45.02,55.56) 34.1,55.56 U7.15
D13: length 48.6
  Top Layer w0.152: H11.5 74.23,49.08 72.83,50.48 47.18,50.48 45.02,52.64 v1(45.02,54.42)
  Bottom Layer w0.152: v1(45.02,54.42) U7.16
D14: length 10.8
  Top Layer w0.152: H12.6 24.7,49.85 v1(31.05,49.85)
  Bottom Layer w0.152: U7.17 32.96,51.66 31.14,49.85 v1(31.05,49.85)
D15: length 15.8
  Top Layer w0.152: H12.5 31.05,48.7 31.81,47.94 36.13,47.94 37.15,48.96 37.15,50.99 36.26,51.88 U7.18
D16: length 11.8
  Top Layer w0.152: U7.19 32.96,49.36 30.8,51.52 30.8,53.93 27.41,57.32 H3.1
D17: length 15.8
  Top Layer w0.152: U7.20 34.23,50.61 32.07,50.61 31.05,51.62 31.05,54.03 25.84,59.24 H3.3
D26: length 47.8
  Top Layer w0.152: H3.4 24.44,61 38.52,61 43.88,66.36 v1(44.13,66.36)
  Bottom Layer w0.152: v1(44.13,66.36) 55.69,66.36 60.52,71.18 64.96,71.18 U7.84
D27: length 40.1
  Top Layer w0.152: v1(67.37,61.66) 73.34,55.69 v1(73.34,55.05) ; H11.2 75.37,38.8 73.72,38.8 72.96,39.56 72.96,43.88 73.34,44.26 v1(73.34,48.7)
  Bottom Layer w0.152: v1(73.34,48.7) v1(73.34,55.05) ; v1(67.37,61.66) 67.37,62.04 66.99,62.42 66.99,67.88 66.71,68.16 64.94,68.16 U7.81
OUT1: length 34
  Bottom Layer w0.254: J2.8 50.85,8.24 62.74,20.13 66.62,20.13 67.81,21.31 67.81,24.14 66.61,25.34 61.79,25.34 60.9,26.22 U7.44
OUT2: length 20.9
  Top Layer w0.254: v1(60.9,19.11) U7.43
  Bottom Layer w0.254: v1(60.9,19.11) 50.35,8.57 J2.9
OUT3: length 22.7
  Top Layer w0.254: v1(63.44,21.53) U7.45
  Bottom Layer w0.254: v1(63.44,21.53) 62.42,21.53 49.85,8.96 J2.10
OUT4: length 24.8
  Bottom Layer w0.254: J2.11 49.35,8.96 62.67,22.29 65.09,22.29 65.98,23.18 U7.46
OUT5: length 26
  Bottom Layer w0.254: J2.12 48.85,12.36 45.66,15.56 42.1,15.56 39.31,18.35 39.31,25.97 38.8,26.48 U7.41
OUT6: length 22.8
  Bottom Layer w0.254: J2.13 48.35,12.35 45.53,15.18 41.97,15.18 38.04,19.11 U7.42
OUT7: length 28.9
  Bottom Layer w0.254: U7.39 32.96,24.45 33.85,25.34 36.13,25.34 37.01,24.46 37.01,19.5 41.74,14.77 45.3,14.77 47.85,12.21 J2.14
OUT8: length 23.5
  Bottom Layer w0.254: J2.15 47.35,12.21 45.15,14.41 41.59,14.41 35.5,20.51 U7.40
PCLK: length 48.7
  Bottom Layer w0.254: J2.1 54.35,6.97 54.63,6.69 54.63,5.32 54.37,5.07 47.87,5.07 45.4,2.6 43.82,2.6 42.88,3.54 42.88,11.79 33.78,20.89 32.83,20.89 31.69,22.03 31.69,26.86 32.58,27.75 34.23,27.75 U7.36
RXD: length 35.6
  Top Layer w0.254: v1(67.63,28.76) 67.63,32.45 U7.54
  Bottom Layer w0.254: v1(67.63,28.76) 68.16,28.23 68.16,21.16 66.72,19.72 63.8,19.72 52.85,8.78 J2.4
TXD: length 35.8
  Bottom Layer w0.254: U7.51 64.71,30.29 67.37,30.29 68.52,29.15 68.52,21.02 66.87,19.37 63.94,19.37 53.35,8.77 J2.3
VSY: length 35.4
  Top Layer w0.254: U7.38 34.35,25.34 v1(34.35,21.14)
  Bottom Layer w0.254: v1(34.35,21.14) 41.47,14.03 44.41,14.03 44.92,13.52 44.92,6.79 46.29,5.42 51.14,5.42 51.85,6.14 J2.6
$1N607: length 16.9
  Bottom Layer w0.762: S1.3 3.87,24.07 5.02,22.92 8.06,22.92 8.57,22.41 8.57,16.05 7.83,15.3 R2.1
$1N608: length 18.9
  Bottom Layer w0.381: S1.1 15.68,23.94 15.68,14.92 14.54,13.78 13.14,13.78 12.9,14.02 R3.1
  Bottom Layer w0.762: D1.2 R3.1
$1N610: length 23.3
  Bottom Layer w0.381: S1.2 9.33,25.59 9.33,15.05 6.67,12.38 6.67,7.56 5.03,5.92 Q1.1
$1N613: length 1.7
  Top Layer w0.381: R1.2 18.1,7.09 POWER.2
$1N2073: length 9.4
  Top Layer w0.254: U5.3 50.12,61.54 50.61,62.04 50.61,63.05 50.22,63.44 U5.1 49.5,63.31 C9.2 47.31,63.81 D4.1
  Top Layer w0.381: 45.73,63.81 C8.1
$1N2078: length 1.7
  Top Layer w0.254: 3v3.2 33.83,76.01 R4.2
$1N2664: length 9.5
  Top Layer w0.254: 45.28,17.62 C20.1 ; 45.28,17.62 D5.1 ; 45.28,17.62 46.78,17.62 C5.2 49.01,17.09 U6.1 49.72,17.2 50.1,16.83 50.1,15.68 49.72,15.3 U6.3
$1N3907: length 18
  Top Layer w0.254: 58.52,9.46 C12.2 ; 58.52,9.46 L3.1 ; 58.52,9.46 58.13,9.08 v1(46.55,9.08)
  Bottom Layer w0.254: v1(46.55,9.08) 45.66,9.08 45.28,8.7 45.28,7.68 45.53,7.43 46.33,7.43 J2.17
$1N4591: length 2.9
  Bottom Layer w0.762: D6.1 14.16,89.5 H10.2
$1N4675: length 2.9
  Bottom Layer w0.762: H9.2 92.18,35.84 D7.1
$1N6084: length 2.8
  Top Layer w0.254: Q2.1 82.82,22.63 R7.2
$1N6086: length 14
  Top Layer w0.254: BUZZER.2 94.3,21.27 92.27,19.24 88.34,19.24 Q2.3
  Bottom Layer w0.381: D8.2 94.3,23.46 BUZZER.2
$1N7130: length 1.8
  Top Layer w0.381: 5V.2 19.49,59.83 R8.2
$1N11056: length 2.6
  Bottom Layer w0.762: D9.1 74.01,92.58 H5.2
$1N11061: length 2.7
  Bottom Layer w0.762: D10.1 86.71,92.49 H6.2

## Copper pours and planes (outline as drawn; the poured copper is in the pictures)
6V on Top Layer: 2.48,63.69 10.48,63.69 10.48,66.99 2.48,66.99
8V_1 on Top Layer: 34.56,88.02 34.56,96.12 34.48,96.2 21.32,96.2 21.32,91.5 31.05,91.5 31.05,88.02
8V_2 on Bottom Layer: 79.69,33.33 87.44,33.33 87.44,34.3 90.08,34.3 90.08,29.88 90.07,29.87 79.69,29.87
8V_3 on Top Layer: 96.41,88.15 96.33,88.22 96.33,95.92 93.03,95.92 93.03,88.96 86.3,88.96 86.3,85.46 92.95,85.46 92.95,88.15
GND on Top Layer: 31.05,87.82 34.48,87.82 34.48,80.56 31.05,80.56 31.05,87.81
GND on Top Layer: 71.44,62.67 79.87,62.67 79.87,59.8 79.82,59.75 71.44,59.75
GND on Top Layer: -10.86,108.14 112.59,108.14 112.59,-18.48 -10.99,-18.48 -10.99,108.01
GND on Top Layer: 66.99,87.85 66.99,79.95 63.46,79.95 63.46,87.85
GND on Top Layer: 1.21,88.45 5.4,88.45 5.4,80.2 1.22,80.2 1.21,80.21
GND on Top Layer: 71.31,33.46 79.94,33.46 79.94,28.64 79.95,28.64 71.3,28.64 71.3,33.45
GND on Top Layer: 10.6,63.69 18.22,63.69 18.22,66.98 10.6,66.9
GND on Top Layer: 10.48,36.77 18.1,36.77 18.1,33.93 16.19,33.93 16.19,30.48 13.71,30.48 13.65,30.54 13.65,33.55 13.49,33.71 10.46,33.71 10.46,36.75
GND on Bottom Layer: -10.99,108.14 112.33,108.14 112.46,108.01 112.46,-18.48 -10.99,-18.48 -11.11,-18.35 -11.11,108.01
GNDBAT on Bottom Layer: 9.84,16.45 9.84,21.53 15.18,21.53 15.18,14.79 14.67,14.29 13.53,14.29 13.53,16.45
VCCBAT on Bottom Layer: 7.05,11.84 20.18,11.84 20.18,3.23 7.05,3.23
VCCBAT on Bottom Layer: 2.6,36.77 10.36,36.77 10.36,29.91 20.89,29.91 20.89,26.3 16.57,26.35 16.57,28.61 2.6,28.61
VCCBAT on Bottom Layer: 16.57,26.22 16.57,33.71 21.4,33.71 21.4,39.69 27.88,39.69 28,39.81 28,33.58 24.56,33.58 24.45,33.58 24.45,30.79 24.32,30.8 20.7,30.8 20.7,26.41 20.89,26.22
VCCBAT on Bottom Layer: 16.57,29.65 20.92,29.65 20.92,18.22 19.62,18.22 19.62,9.96 19.56,10.01 16.57,10.01
VCCBAT on Bottom Layer: 0.7,88.08 67.05,88.08 67.05,96.33 0.7,96.33
VCCBAT on Bottom Layer: 61.41,88.19 61.41,96.19 61.4,96.2 69.77,96.2 69.77,64.58 88.33,64.58 88.33,52.89 79.82,52.89 79.82,61.97 79.94,62.1 67.37,62.1 67.37,75.25 61.4,75.25 61.4,88.18
VCCBAT on Bottom Layer: 0.7,33.34 0.7,96.33 5.14,96.33 5.14,88.07 2.33,88.07 2.33,37.23 10.27,37.23 10.35,37.15 10.35,33.59 10.6,33.34
$1N609 on Bottom Layer: 2.86,21.78 7.81,21.78 7.81,16.7 5.3,16.7 5.27,16.67 5.27,11.84 6.27,11.84 6.27,9.03 2.22,9.03 2.22,11.71 2.98,11.71 2.98,21.65

Small or netless copper shapes (teardrops, artwork), in the pictures only: 326 on Top Layer, 228 on Bottom Layer

## Text on the board
Bottom Silkscreen Layer: HUMAN | CARMAR
Top Layer: HZCU | 2024 | DEBUG
Top Silkscreen Layer: OPENAIR | GYRO | ON | +
